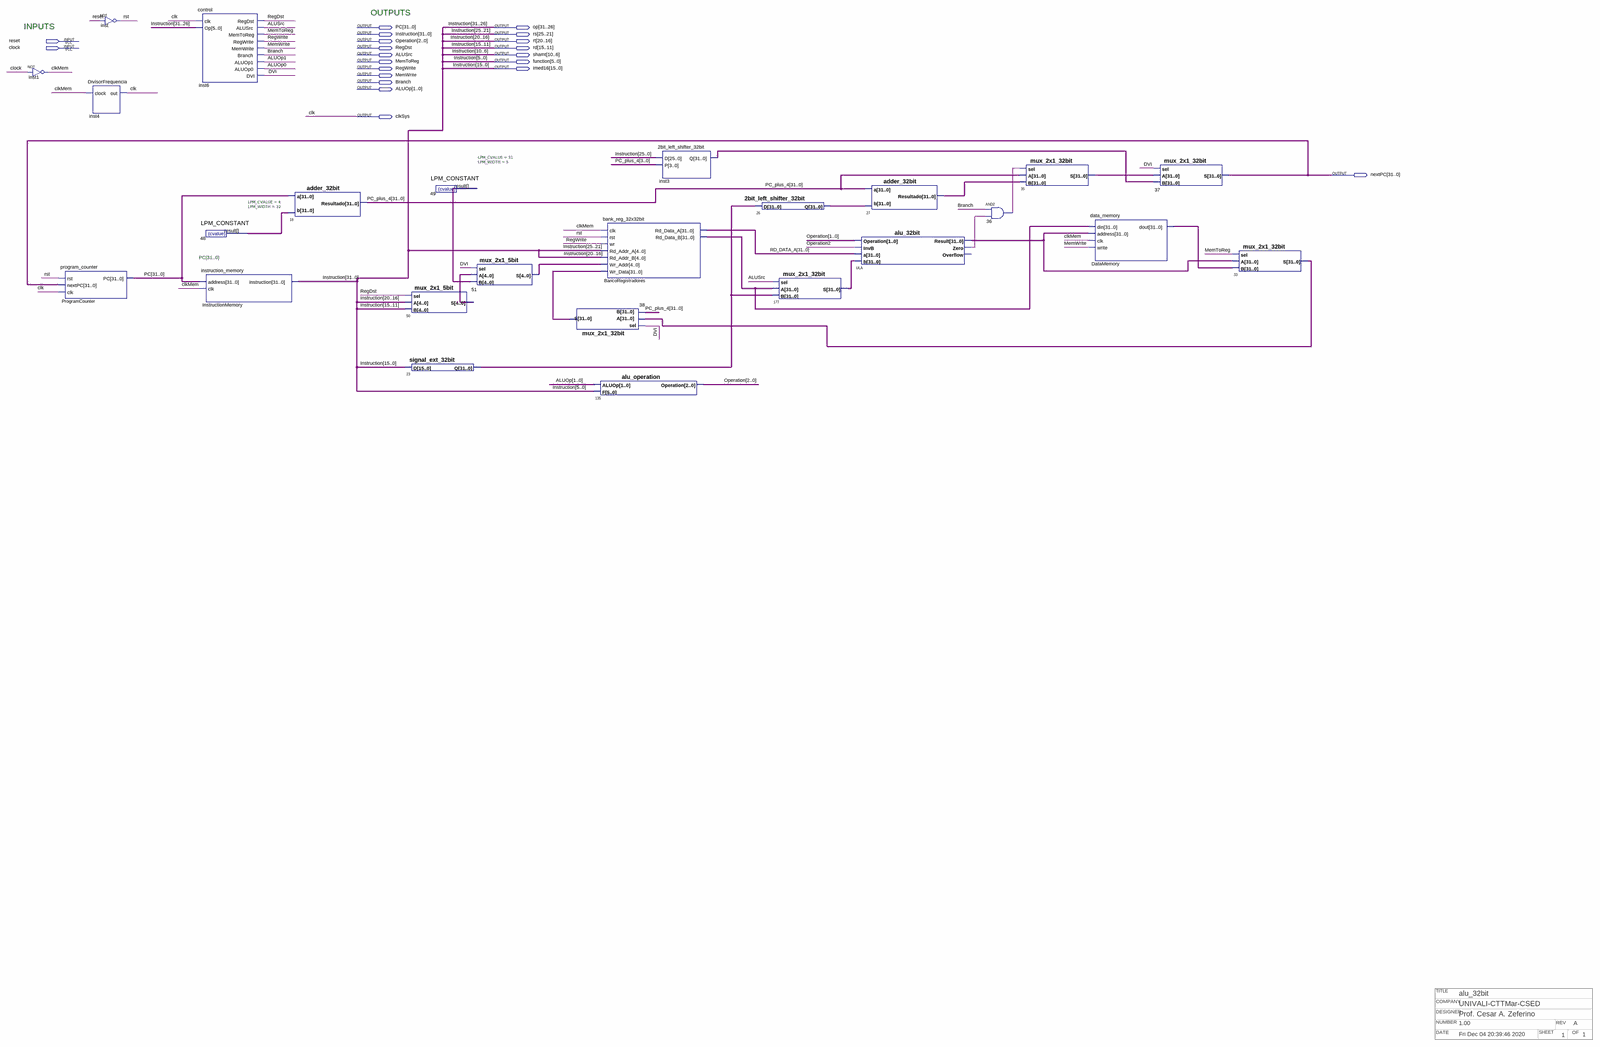
[diagram p0: schematic sheet, whole]
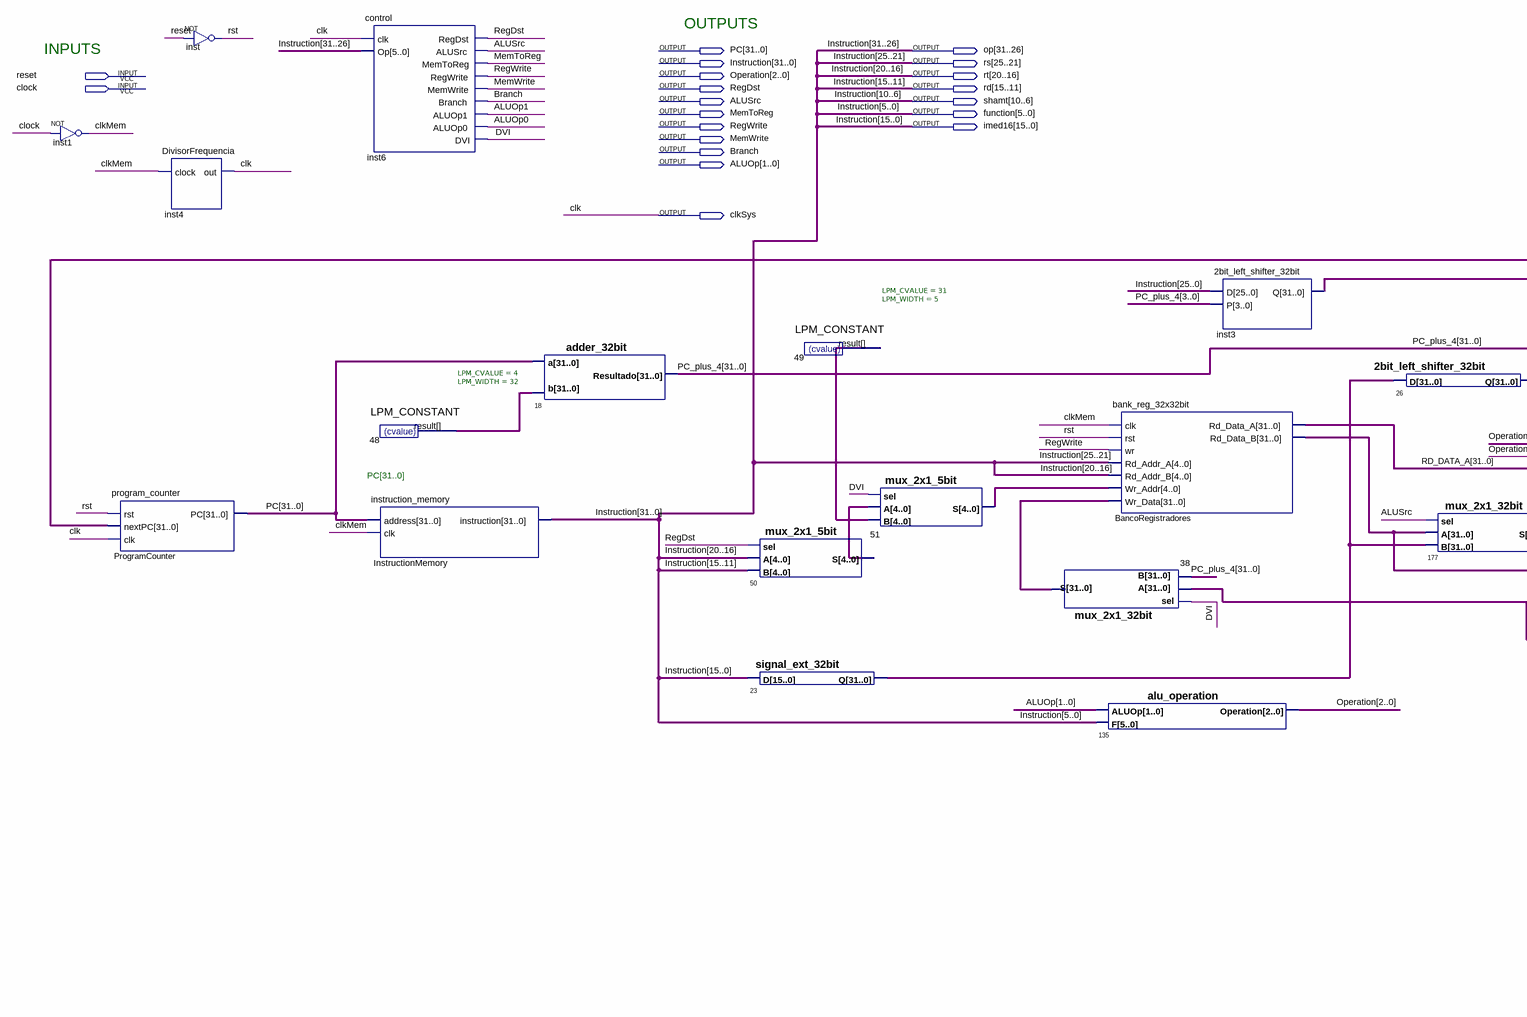
[diagram p1: schematic sheet, upper left part]
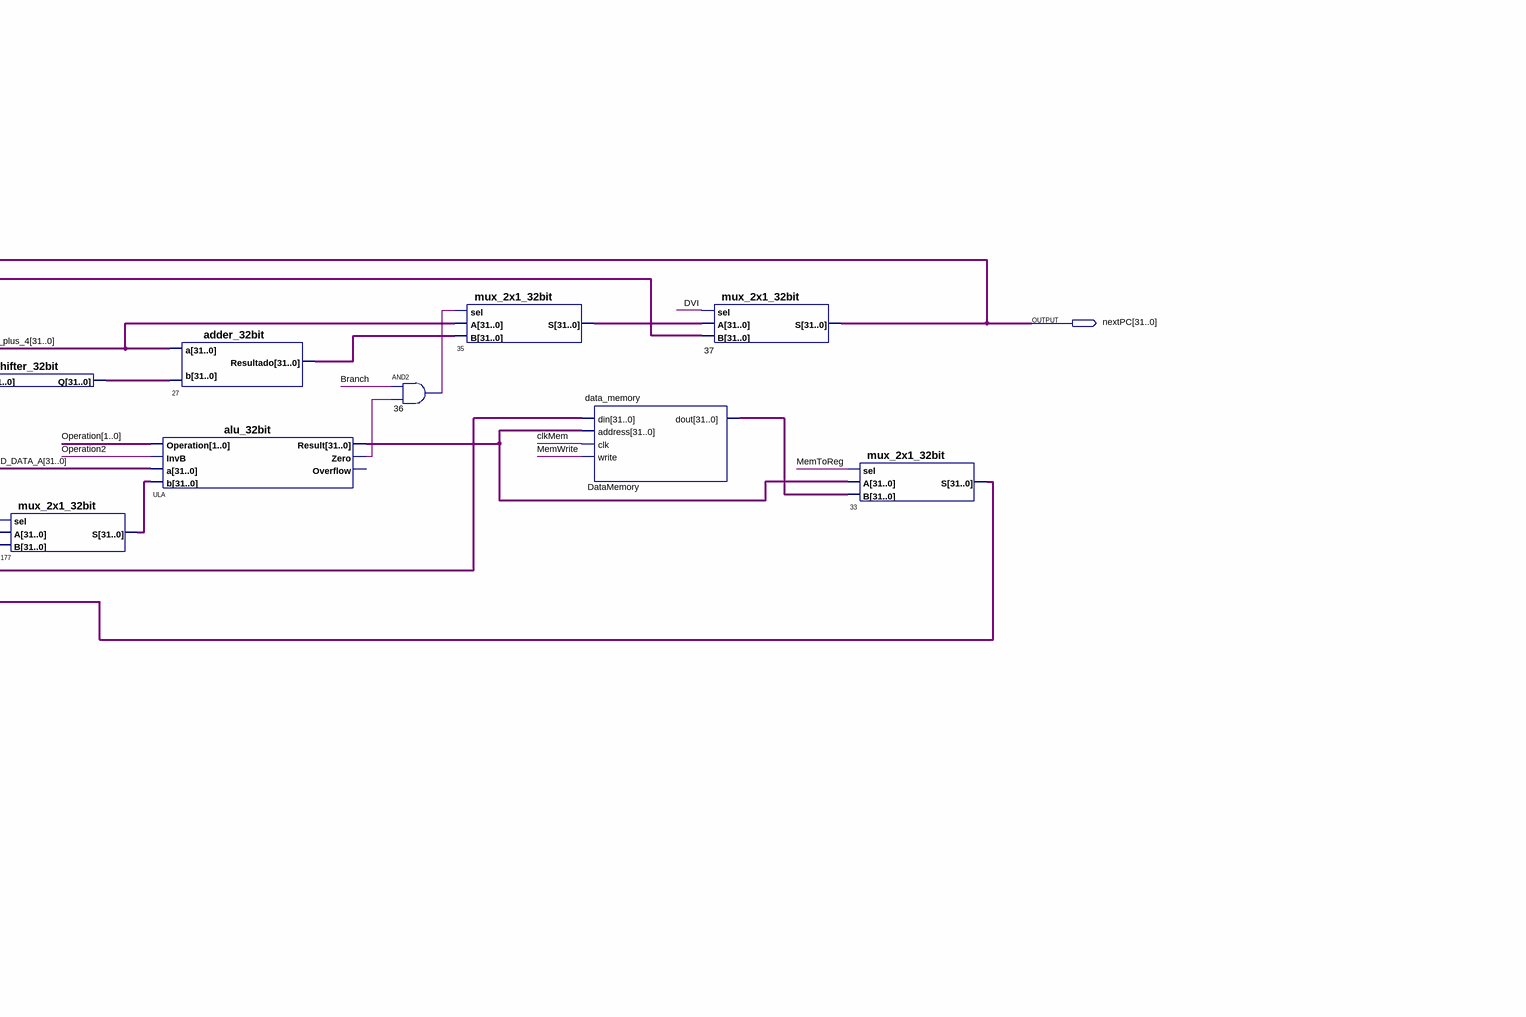
[diagram p2: schematic sheet, upper right part]
// Quartus schematic mips_mono.bdf as structural Verilog: 25 symbols, 21 pins
// Title block: TITLE: alu_32bit; COMPANY: UNIVALI-CTTMar-CSED; DESIGNER: Prof. Cesar A. Zeferino; NUMBER: 1.00; REV: A; DATE: Fri Dec 04 20:39:46 2020; SHEET: 1; OF: 1
module mips_mono (
  input  reset,
  input  clock,
  output [31:0] PC,
  output [31:26] op,
  output [31:0] Instruction,
  output [25:21] rs,
  output [2:0] Operation,
  output [20:16] rt,
  output RegDst,
  output [15:11] rd,
  output ALUSrc,
  output [10:6] shamt,
  output MemToReg,
  output [5:0] \function ,
  output RegWrite,
  output [15:0] imed16,
  output MemWrite,
  output Branch,
  output [1:0] ALUOp,
  output clkSys,
  output [31:0] nextPC
);

  wire clkMem, DVI, n36_out, rst, ULA_zero;
  wire [4:0] n49_result, n50_s, n51_s;
  wire [31:0] BancoRegistradores_rd_data_b, DataMemory_dout, inst3_q, n23_q, n26_q, n27_resultado, n33_s,
       n35_s, n38_s, n48_result, n177_s, PC_plus_4, RD_DATA_A, ULA_result;

  not inst1 (clkMem, clock);
  program_counter ProgramCounter (.rst(rst), .nextPC(nextPC), .clk(clkSys), .PC(PC));
  not inst (rst, reset);
  DivisorFrequencia inst4 (.clock(clkMem), .out(clkSys));
  control inst6 (
    .clk(clkSys), .Op(Instruction[31:26]), .RegDst(RegDst), .ALUSrc(ALUSrc), .MemToReg(MemToReg),
    .RegWrite(RegWrite), .MemWrite(MemWrite), .Branch(Branch), .ALUOp1(ALUOp[1]), .ALUOp0(ALUOp[0]), .DVI(DVI));
  LPM_CONSTANT #(.LPM_CVALUE(4), .LPM_WIDTH(32)) u_48 (.result(n48_result));
  instruction_memory InstructionMemory (
    .address(PC), .clk(clkMem), .instruction({Instruction[31:16], imed16[15:6], \function }));
  adder_32bit u_18 (.a(PC), .b(n48_result), .Resultado(PC_plus_4));
  mux_2x1_5bit u_50 (.sel(RegDst), .A(Instruction[20:16]), .B(imed16[15:11]), .S(n50_s));
  signal_ext_32bit u_23 (.D({imed16[15:6], \function }), .Q(n23_q));
  LPM_CONSTANT #(.LPM_CVALUE(31), .LPM_WIDTH(5)) u_49 (.result(n49_result));
  mux_2x1_5bit u_51 (.sel(DVI), .A(n50_s), .B(n49_result), .S(n51_s));
  mux_2x1_32bit u_38 (.sel(DVI), .A(n33_s), .B(PC_plus_4), .S(n38_s));
  alu_operation u_135 (.ALUOp(ALUOp), .F(\function ), .Operation(Operation));
  bank_reg_32x32bit BancoRegistradores (
    .clk(clkMem), .rst(rst), .wr(RegWrite), .Rd_Addr_A(Instruction[20:16]), .Rd_Addr_B(Instruction[20:16]),
    .Wr_Addr(n51_s), .Wr_Data(n38_s), .Rd_Data_A(RD_DATA_A), .Rd_Data_B(BancoRegistradores_rd_data_b));
  \2bit_left_shifter_32bit  inst3 (.D({Instruction[25:16], imed16[15:6], \function }), .P(PC_plus_4[3:0]), .Q(inst3_q));
  \2bit_left_shifter_32bit  u_26 (.D(n23_q), .Q(n26_q));
  mux_2x1_32bit u_177 (.sel(ALUSrc), .A(BancoRegistradores_rd_data_b), .B(n23_q), .S(n177_s));
  adder_32bit u_27 (.a(PC_plus_4), .b(n26_q), .Resultado(n27_resultado));
  alu_32bit ULA (
    .Operation(Operation[1:0]), .InvB(Operation[2]), .a(RD_DATA_A), .b(n177_s), .Result(ULA_result),
    .Zero(ULA_zero));  // open: Overflow
  and u_36 (n36_out, Branch, ULA_zero);
  mux_2x1_32bit u_35 (.sel(n36_out), .A(PC_plus_4), .B(n27_resultado), .S(n35_s));
  data_memory DataMemory (
    .din(BancoRegistradores_rd_data_b), .address(ULA_result), .clk(clkMem), .write(MemWrite),
    .dout(DataMemory_dout));
  mux_2x1_32bit u_37 (.sel(DVI), .A(n35_s), .B(inst3_q), .S(nextPC));
  mux_2x1_32bit u_33 (.sel(MemToReg), .A(ULA_result), .B(DataMemory_dout), .S(n33_s));

  assign imed16[5:0] = \function ;
  assign Instruction[15:0] = {imed16[15:6], \function };
  assign op = Instruction[31:26];
  assign rd = imed16[15:11];
  assign rs = Instruction[25:21];
  assign rt = Instruction[20:16];
  assign shamt = imed16[10:6];

  // Other names for the same wires on the sheet: clk = clkSys

  // Notes on the sheet:
  //   OUTPUTS
  //   INPUTS
  //   PC[31..0]
endmodule
